# Altium schematic sheet JH Debug.SchDoc
size A4
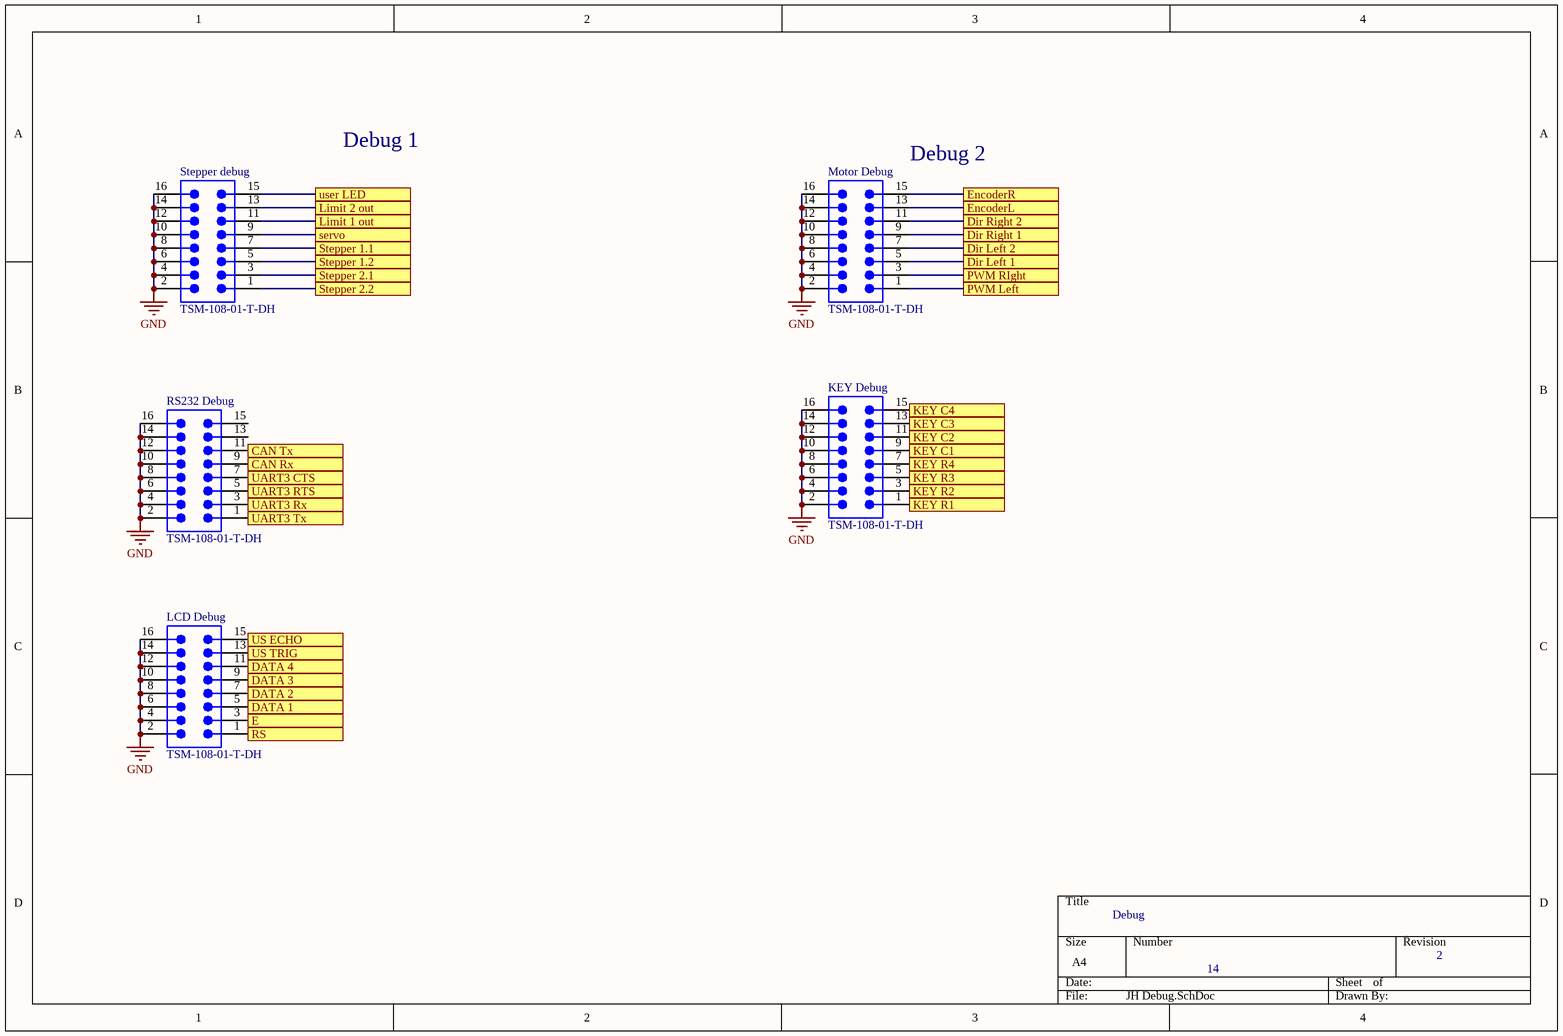
[diagram p0: JH Debug.SchDoc]

## Parts
KEY_Debug  TSM-108-01-T-DH  [SMTC-TSM-108-01-X-DH]
LCD_Debug  TSM-108-01-T-DH  [SMTC-TSM-108-01-X-DH]
Motor_Debug  TSM-108-01-T-DH  [SMTC-TSM-108-01-X-DH]
RS232_Debug  TSM-108-01-T-DH  [SMTC-TSM-108-01-X-DH]
Stepper_debug  TSM-108-01-T-DH  [SMTC-TSM-108-01-X-DH]

## Ports
CAN Rx (see JH Topsheet[2C], JH CAN[1B]), CAN Tx (see JH Topsheet[2C], JH CAN[1B]), DATA 1 (see JH Topsheet[2D], JH DAC and LCD[3C]), DATA 2 (see JH Topsheet[2D], JH DAC and LCD[3C]), DATA 3 (see JH Topsheet[2D], JH DAC and LCD[3C]), DATA 4 (see JH Topsheet[2D], JH DAC and LCD[3C]), Dir Left 1 (see JH Topsheet[3D], JHdriveMotor[1A]), Dir Left 2 (see JH Topsheet[3D], JHdriveMotor[1A]), Dir Right 1 (see JH Topsheet[3D], JHdriveMotor[1B]), Dir Right 2 (see JH Topsheet[3D], JHdriveMotor[1B]), E (see JH Topsheet[2D], JH DAC and LCD[3B]), EncoderL (see JH Topsheet[3C]), EncoderR (see JH Topsheet[3C]), KEY C1 (see JH Topsheet[2D], JH KEY PAD[2B]), KEY C2 (see JH Topsheet[2D], JH KEY PAD[2B]), KEY C3 (see JH Topsheet[2D], JH KEY PAD[2B]), KEY C4 (see JH Topsheet[2D], JH KEY PAD[2B]), KEY R1 (see JH Topsheet[2D], JH KEY PAD[2B]), KEY R2 (see JH Topsheet[2D], JH KEY PAD[2B]), KEY R3 (see JH Topsheet[2D], JH KEY PAD[2B]), KEY R4 (see JH Topsheet[2D], JH KEY PAD[2B]), Limit 1 out (see JH Topsheet[3D], JH stepper and encoder[4C]), Limit 2 out (see JH Topsheet[3D], JH stepper and encoder[3D]), PWM Left (see JH Topsheet[3D], JHdriveMotor[1B]), PWM RIght (see JH Topsheet[3D], JHdriveMotor[1B]), RS (see JH Topsheet[2D], JH DAC and LCD[3B]), servo (see JH Topsheet[3D], JH stepper and encoder[3A]), Stepper 1.1 (see JH Topsheet[3C], JH stepper and encoder[1A]), Stepper 1.2 (see JH Topsheet[3C], JH stepper and encoder[1A]), Stepper 2.1 (see JH Topsheet[3C], JH stepper and encoder[1A]), Stepper 2.2 (see JH Topsheet[3C], JH stepper and encoder[1A]), UART3 CTS (see JH Topsheet[2C]), UART3 RTS (see JH Topsheet[2C]), UART3 Rx (see JH Topsheet[2C]), UART3 Tx (see JH Topsheet[2C]), US ECHO (see JH Topsheet[2D], JH Ultrasonic sensor[2B]), US TRIG (see JH Topsheet[2D], JH Ultrasonic sensor[2B]), user LED (see JH Topsheet[3D], JH User LED[2B])

## Nets
GND: KEY_Debug.2 KEY_Debug.4 KEY_Debug.6 KEY_Debug.8 KEY_Debug.10 KEY_Debug.12 KEY_Debug.14 KEY_Debug.16 LCD_Debug.2 LCD_Debug.4 LCD_Debug.6 LCD_Debug.8 LCD_Debug.10 LCD_Debug.12 LCD_Debug.14 LCD_Debug.16 Motor_Debug.2 Motor_Debug.4 Motor_Debug.6 Motor_Debug.8 Motor_Debug.10 Motor_Debug.12 Motor_Debug.14 Motor_Debug.16 RS232_Debug.2 RS232_Debug.4 RS232_Debug.6 RS232_Debug.8 RS232_Debug.10 RS232_Debug.12 RS232_Debug.14 RS232_Debug.16 Stepper_debug.2 Stepper_debug.4 Stepper_debug.6 Stepper_debug.8 Stepper_debug.10 Stepper_debug.12 Stepper_debug.14 Stepper_debug.16
CAN Rx: RS232_Debug.9 ; port CAN Rx
CAN Tx: RS232_Debug.11 ; port CAN Tx
DATA 1: LCD_Debug.5 ; port DATA 1
DATA 2: LCD_Debug.7 ; port DATA 2
DATA 3: LCD_Debug.9 ; port DATA 3
DATA 4: LCD_Debug.11 ; port DATA 4
Dir Left 1: Motor_Debug.5 ; port Dir Left 1
Dir Left 2: Motor_Debug.7 ; port Dir Left 2
Dir Right 1: Motor_Debug.9 ; port Dir Right 1
Dir Right 2: Motor_Debug.11 ; port Dir Right 2
E: LCD_Debug.3 ; port E
EncoderL: Motor_Debug.13 ; port EncoderL
EncoderR: Motor_Debug.15 ; port EncoderR
KEY C1: KEY_Debug.9 ; port KEY C1
KEY C2: KEY_Debug.11 ; port KEY C2
KEY C3: KEY_Debug.13 ; port KEY C3
KEY C4: KEY_Debug.15 ; port KEY C4
KEY R1: KEY_Debug.1 ; port KEY R1
KEY R2: KEY_Debug.3 ; port KEY R2
KEY R3: KEY_Debug.5 ; port KEY R3
KEY R4: KEY_Debug.7 ; port KEY R4
Limit 1 out: Stepper_debug.11 ; port Limit 1 out
Limit 2 out: Stepper_debug.13 ; port Limit 2 out
PWM Left: Motor_Debug.1 ; port PWM Left
PWM RIght: Motor_Debug.3 ; port PWM RIght
RS: LCD_Debug.1 ; port RS
servo: Stepper_debug.9 ; port servo
Stepper 1.1: Stepper_debug.7 ; port Stepper 1.1
Stepper 1.2: Stepper_debug.5 ; port Stepper 1.2
Stepper 2.1: Stepper_debug.3 ; port Stepper 2.1
Stepper 2.2: Stepper_debug.1 ; port Stepper 2.2
UART3 CTS: RS232_Debug.7 ; port UART3 CTS
UART3 RTS: RS232_Debug.5 ; port UART3 RTS
UART3 Rx: RS232_Debug.3 ; port UART3 Rx
UART3 Tx: RS232_Debug.1 ; port UART3 Tx
US ECHO: LCD_Debug.15 ; port US ECHO
US TRIG: LCD_Debug.13 ; port US TRIG
user LED: Stepper_debug.15 ; port user LED

Not connected (* = marked no-connect by the designer): RS232_Debug 13 15

## Notes on the sheet
- Debug 1
- (near Motor_Debug) Debug 2
- Debug
- 14
- 2

## Library data of the parts
KEY_Debug LCD_Debug Motor_Debug RS232_Debug Stepper_debug = CMP-1024-00267-1: 0.025" SQ Post Header, Surface Mount, Horizontal, -55 to 105 degC, 2.54 mm Pitch, 16-Pin, Male, RoHS; Manufacturer: Samtec; Pitch: 2.54 mm; Mounting Technology: Surface Mount; DatasheetVersion: F-214; PackageVersion: CH, 7/1995; PackageReference: TSM-108-01-X-DH; Orientation: Horizontal; ComponentLink2URL: http://www.samtec.com/documents/webfiles/pdf/TSM.PDF; PackageDescription: Terminal Strip Double Surface Mount; ComponentLink1URL: http://www.samtec.com; ComponentLink3URL: http://www.samtec.com/documents/webfiles/cpdf/TSM-1XX-XX-XXX-XX-XX-XXX-XX-MKT1.pdf; ComponentLink1Description: Manufacturer URL; ComponentLink3Description: Package Specification; PartNumber: TSM-108-01-T-DH; Temperature Range: -55 to 105 degC; RoHS: True; ComponentLink2Description: Datasheet